# Altium schematic sheet STM32.SchDoc
size A; SheetNumber: 1; SheetTotal: 8
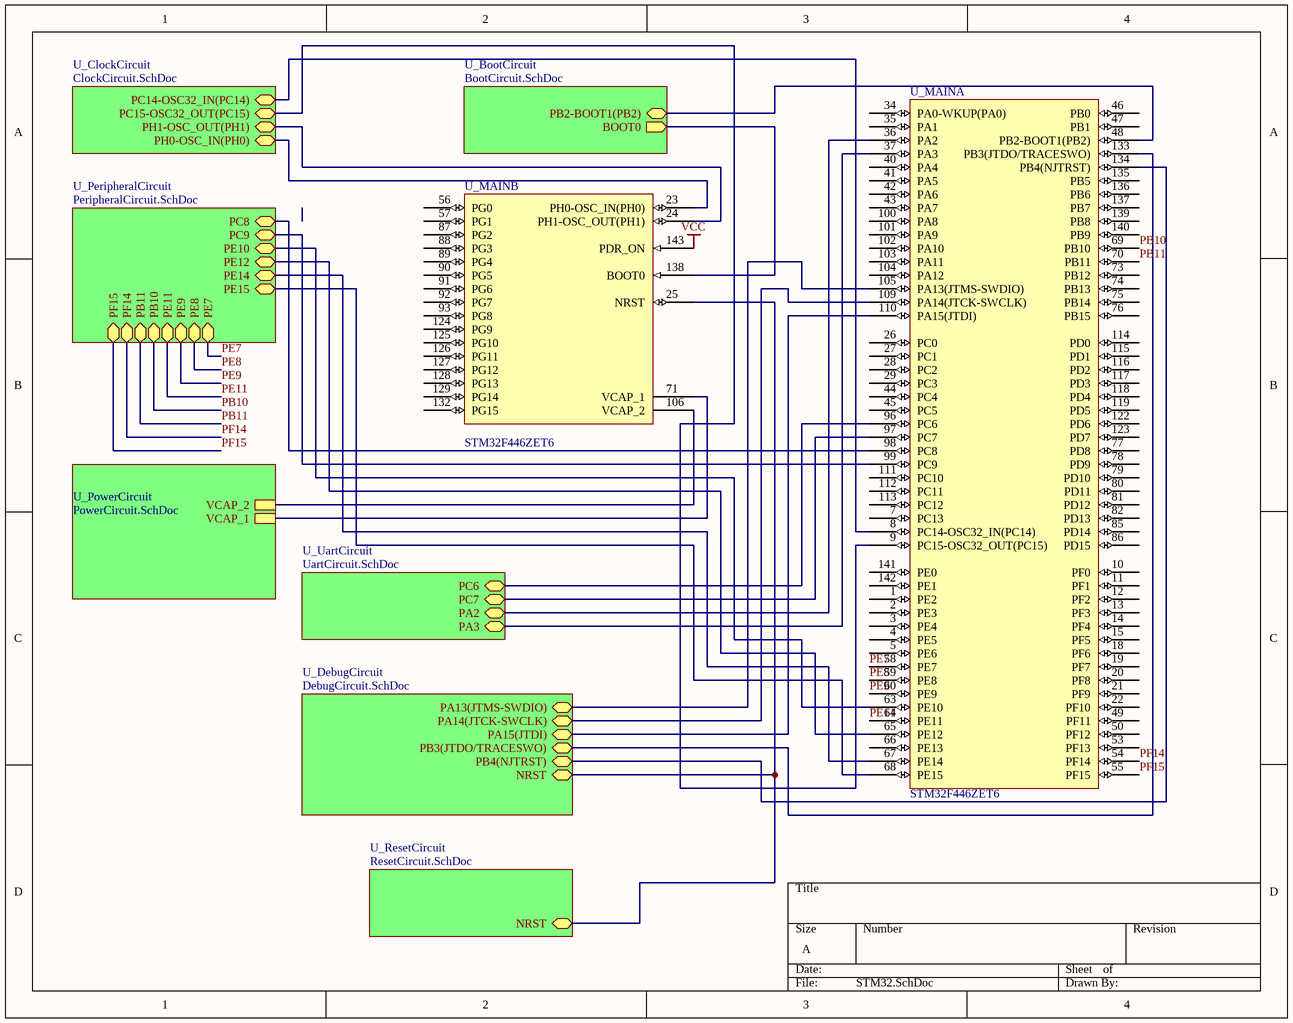
[diagram p0: STM32.SchDoc]

## Parts
U_MAIN  STM32F446ZET6  [STM-LQFP144_M]  (parts A,B of 3)

## Sub-sheets
U_BootCircuit = BootCircuit.SchDoc: BOOT0 (out), PB2-BOOT1(PB2) (bidir)
U_ClockCircuit = ClockCircuit.SchDoc: PC14-OSC32_IN(PC14) (bidir), PC15-OSC32_OUT(PC15) (bidir), PH1-OSC_OUT(PH1) (bidir), PH0-OSC_IN(PH0) (bidir)
U_DebugCircuit = DebugCircuit.SchDoc: PA13(JTMS-SWDIO) (bidir), PA14(JTCK-SWCLK) (bidir), PA15(JTDI) (bidir), PB3(JTDO/TRACESWO) (bidir), PB4(NJTRST) (bidir), NRST (bidir)
U_PeripheralCircuit = PeripheralCircuit.SchDoc: PC8 (bidir), PC9 (bidir), PE10 (bidir), PE12 (bidir), PE14 (bidir), PE15 (bidir), PE7 (bidir), PE8 (bidir), PE9 (bidir), PE11 (bidir), PB10 (bidir), PB11 (bidir), PF14 (bidir), PF15 (bidir)
U_PowerCircuit = PowerCircuit.SchDoc: VCAP_1, VCAP_2
U_ResetCircuit = ResetCircuit.SchDoc: NRST (bidir)
U_UartCircuit = UartCircuit.SchDoc: PC6 (bidir), PC7 (bidir), PA2 (bidir), PA3 (bidir)

## Nets
VCC: U_MAIN.143(PDR_ON)
PB10: U_MAIN.69(PB10) ; sheet U_PeripheralCircuit/PB10
PB11: U_MAIN.70(PB11) ; sheet U_PeripheralCircuit/PB11
PE7: U_MAIN.58(PE7) ; sheet U_PeripheralCircuit/PE7
PE8: U_MAIN.59(PE8) ; sheet U_PeripheralCircuit/PE8
PE9: U_MAIN.60(PE9) ; sheet U_PeripheralCircuit/PE9
PE11: U_MAIN.64(PE11) ; sheet U_PeripheralCircuit/PE11
PF14: U_MAIN.54(PF14) ; sheet U_PeripheralCircuit/PF14
PF15: U_MAIN.55(PF15) ; sheet U_PeripheralCircuit/PF15
NetU_MAIN_8: U_MAIN.8(PC14-OSC32_IN(PC14)) ; sheet U_ClockCircuit/PC14-OSC32_IN(PC14)
NetU_MAIN_9: U_MAIN.9(PC15-OSC32_OUT(PC15)) ; sheet U_ClockCircuit/PC15-OSC32_OUT(PC15)
NetU_MAIN_23: U_MAIN.23(PH0-OSC_IN(PH0)) ; sheet U_ClockCircuit/PH0-OSC_IN(PH0)
NetU_MAIN_24: U_MAIN.24(PH1-OSC_OUT(PH1)) ; sheet U_ClockCircuit/PH1-OSC_OUT(PH1)
NetU_MAIN_25: U_MAIN.25(NRST) ; sheet U_ResetCircuit/NRST, sheet U_DebugCircuit/NRST
NetU_MAIN_36: U_MAIN.36(PA2) ; sheet U_UartCircuit/PA2
NetU_MAIN_37: U_MAIN.37(PA3) ; sheet U_UartCircuit/PA3
NetU_MAIN_48: U_MAIN.48(PB2-BOOT1(PB2)) ; sheet U_BootCircuit/PB2-BOOT1(PB2)
NetU_MAIN_63: U_MAIN.63(PE10) ; sheet U_PeripheralCircuit/PE10
NetU_MAIN_65: U_MAIN.65(PE12) ; sheet U_PeripheralCircuit/PE12
NetU_MAIN_67: U_MAIN.67(PE14) ; sheet U_PeripheralCircuit/PE14
NetU_MAIN_68: U_MAIN.68(PE15) ; sheet U_PeripheralCircuit/PE15
NetU_MAIN_71: U_MAIN.71(VCAP_1) ; sheet U_PowerCircuit/VCAP_1
NetU_MAIN_96: U_MAIN.96(PC6) ; sheet U_UartCircuit/PC6
NetU_MAIN_97: U_MAIN.97(PC7) ; sheet U_UartCircuit/PC7
NetU_MAIN_98: U_MAIN.98(PC8) ; sheet U_PeripheralCircuit/PC8
NetU_MAIN_99: U_MAIN.99(PC9) ; sheet U_PeripheralCircuit/PC9
NetU_MAIN_105: U_MAIN.105(PA13(JTMS-SWDIO)) ; sheet U_DebugCircuit/PA13(JTMS-SWDIO)
NetU_MAIN_106: U_MAIN.106(VCAP_2) ; sheet U_PowerCircuit/VCAP_2
NetU_MAIN_109: U_MAIN.109(PA14(JTCK-SWCLK)) ; sheet U_DebugCircuit/PA14(JTCK-SWCLK)
NetU_MAIN_110: U_MAIN.110(PA15(JTDI)) ; sheet U_DebugCircuit/PA15(JTDI)
NetU_MAIN_133: U_MAIN.133(PB3(JTDO/TRACESWO)) ; sheet U_DebugCircuit/PB3(JTDO/TRACESWO)
NetU_MAIN_134: U_MAIN.134(PB4(NJTRST)) ; sheet U_DebugCircuit/PB4(NJTRST)
NetU_MAIN_138: U_MAIN.138(BOOT0) ; sheet U_BootCircuit/BOOT0

Not connected (* = marked no-connect by the designer): U_MAIN 1(PE2) 2(PE3) 3(PE4) 4(PE5) 5(PE6) 7(PC13) 10(PF0) 11(PF1) 12(PF2) 13(PF3) 14(PF4) 15(PF5) 18(PF6) 19(PF7) 20(PF8) 21(PF9) 22(PF10) 26(PC0) 27(PC1) 28(PC2) 29(PC3) 34(PA0-WKUP(PA0)) 35(PA1) 40(PA4) 41(PA5) 42(PA6) 43(PA7) 44(PC4) 45(PC5) 46(PB0) 47(PB1) 49(PF11) 50(PF12) 53(PF13) 56(PG0) 57(PG1) 66(PE13) 73(PB12) 74(PB13) 75(PB14) 76(PB15) 77(PD8) 78(PD9) 79(PD10) 80(PD11) 81(PD12) 82(PD13) 85(PD14) 86(PD15) 87(PG2) 88(PG3) 89(PG4) 90(PG5) 91(PG6) 92(PG7) 93(PG8) 100(PA8) 101(PA9) 102(PA10) 103(PA11) 104(PA12) 111(PC10) 112(PC11) 113(PC12) 114(PD0) 115(PD1) 116(PD2) 117(PD3) 118(PD4) 119(PD5) 122(PD6) 123(PD7) 124(PG9) 125(PG10) 126(PG11) 127(PG12) 128(PG13) 129(PG14) 132(PG15) 135(PB5) 136(PB6) 137(PB7) 139(PB8) 140(PB9) 141(PE0) 142(PE1)

## Library data of the parts
U_MAIN = CMP-0243-00226-1: ARM Cortex-M4 32-bit MCU+FPU, 512 KB Flash, 128 KB Internal RAM, 114 I/Os, 144-Pin LQFP, -40 to 85 degC, Tray; Operating Frequency(F) (Processor speed) (MHz): 180; Internal RAM Size (kB): 128; FLASH Size (Prog) (kB): 512; I/Os (High Current): 114; D/A Converter: 2; Supply Voltage(Vcc) min (V): 1.7; DatasheetVersion: Rev. 6; Package Reference: 144-Pin Low Profile Quad Flat Package, Body 20 x 20 mm, Pitch 0.5 mm; Package Description: LQFP144; ComponentLink2Description: Datasheet; ComponentLink2URL: http://www.st.com/st-web-ui/static/active/en/resource/technical/document/datasheet/DM00141306.pdf; Mounting Technology: Surface Mount; ComponentLink1Description: Manufacturer URL; Core: ARM Cortex-M4; ComponentLink1URL: http://www.st.com/; Packing: Tray